# EAGLE design KLJN_DemoPanel_2 (EAGLE 5.11)
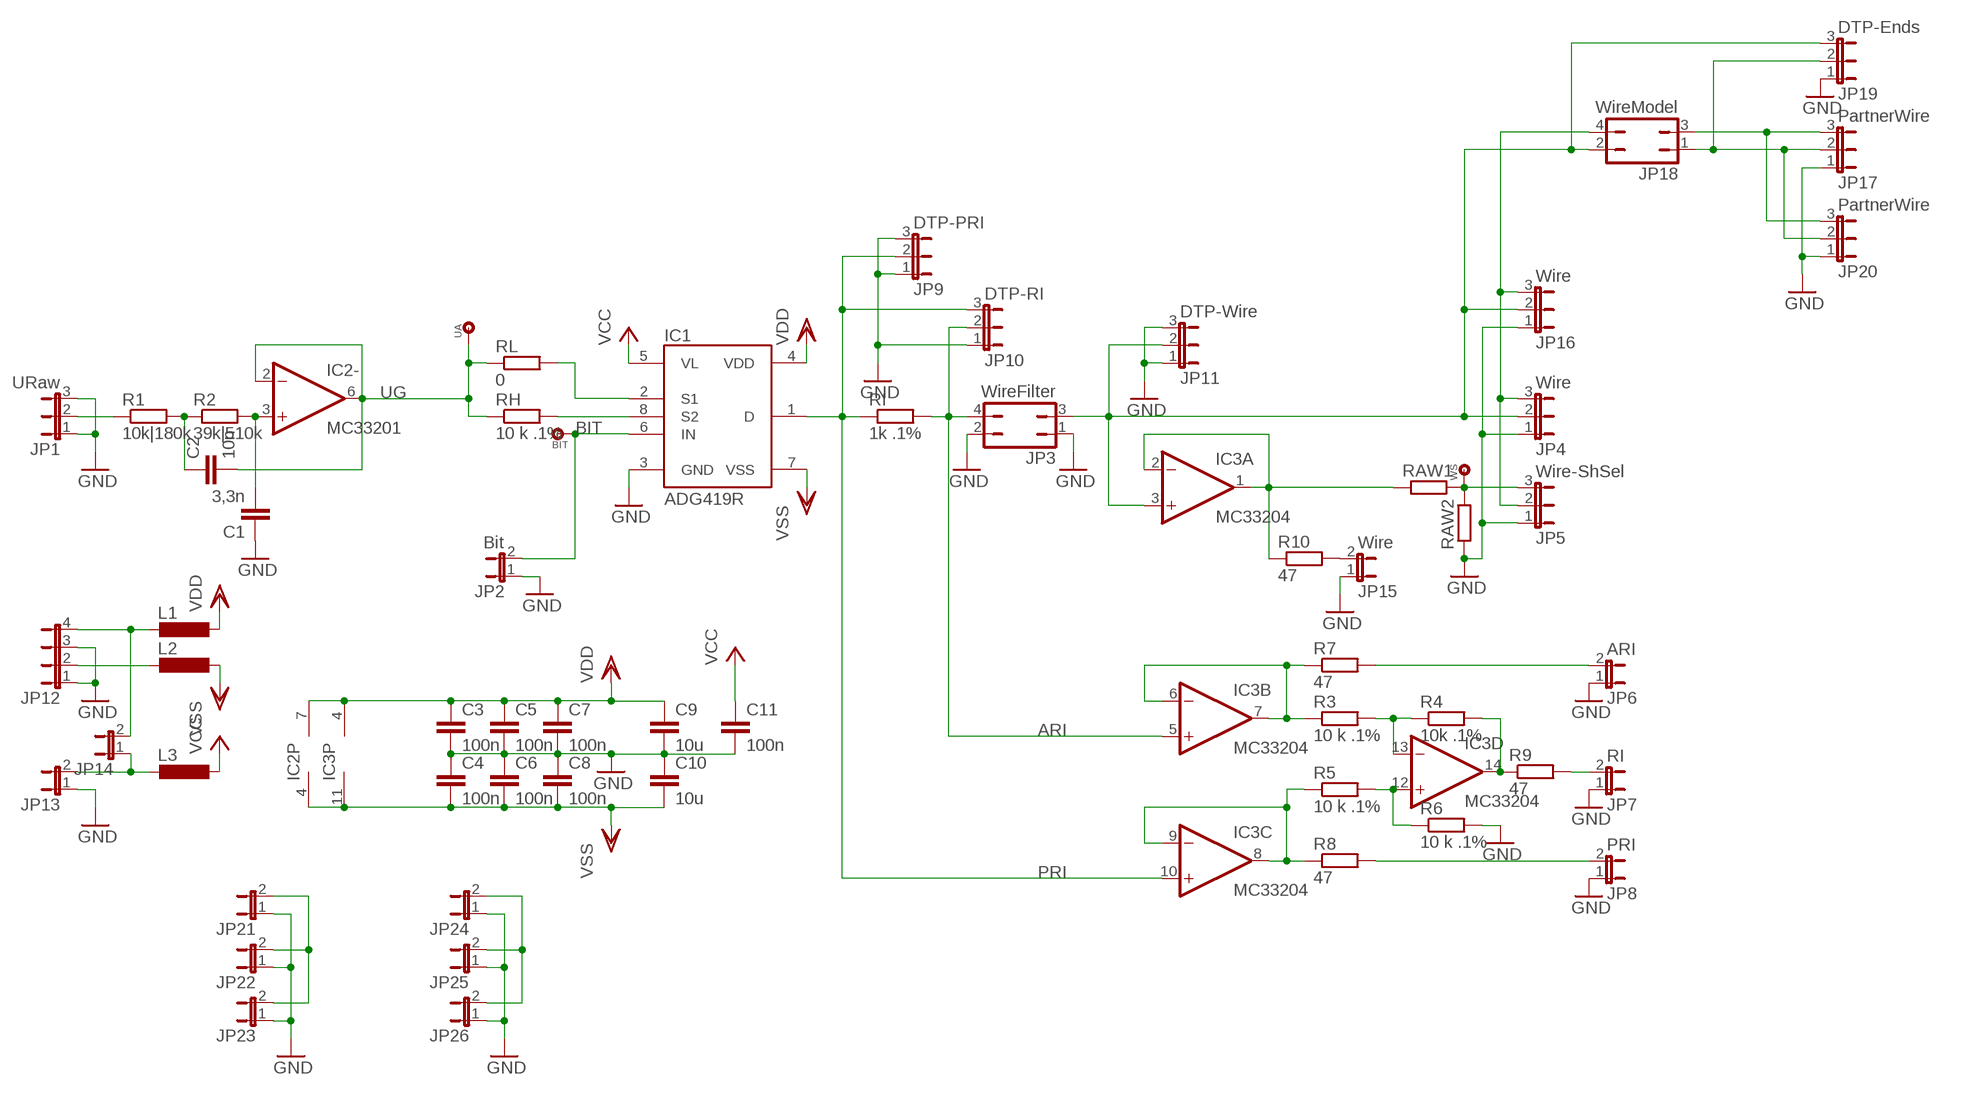
[diagram p0: schematic, sheet 1]

## Parts
BIT  TP  [JP1]
C1  3,3n  CJP  [RJ2_A]
C2  10n  CJP  [RJ2_A]
C3  100n  C1206  [C1206]
C4  100n  C0805  [C0805]
C5  100n  C0805  [C0805]
C6  100n  C0805  [C0805]
C7  100n  C1206  [C1206]
C8  100n  C0805  [C0805]
C9  10u  C0805  [C0805]
C10  10u  C0805  [C0805]
C11  100n  C0805  [C0805]
IC1  ADG419R  ADG419BR  [SO08]
IC2  MC33201  OPASO08  [SO08]
IC3  MC33204  OPA_QUADSO14  [SO14]
JP1  URaw  JP2E  [JP2]
JP2  Bit  JP1E  [JP1]
JP3  WireFilter  JP2Q  [JP2Q]
JP4  Wire  JP2E  [JP2]
JP5  Wire-ShSel  JP2E  [JP2]
JP6  ARI  JP1E  [JP1]
JP7  RI  JP1E  [JP1]
JP8  PRI  JP1E  [JP1]
JP9  DTP-PRI  JP2E  [JP2]
JP10  DTP-RI  JP2E  [JP2]
JP11  DTP-Wire  JP2E  [JP2]
JP12  JP4E  [JP4]
JP13  JP1E  [JP1]
JP14  JP1E  [JP1]
JP15  Wire  JP1E  [JP1]
JP16  Wire  JP2E  [JP2]
JP17  PartnerWire  JP2E  [JP2]
JP18  WireModel  JP2Q  [JP2Q]
JP19  DTP-Ends  JP2E  [JP2]
JP20  PartnerWire  JP2E  [JP2]
JP21  JP1E  [JP1]
JP22  JP1E  [JP1]
JP23  JP1E  [JP1]
JP24  JP1E  [JP1]
JP25  JP1E  [JP1]
JP26  JP1E  [JP1]
L1  L0805  [R0805]
L2  L0805  [R0805]
L3  L0805  [R0805]
R1  10k|180k  RJP  [RJ2_A]
R2  39k|510k  RJP  [RJ2_A]
R3  10 k .1%  R0805  [R0805]
R4  10k .1%  R0805  [R0805]
R5  10 k .1%  R1206  [R1206]
R6  10 k .1%  R0805  [R0805]
R7  47  R0805  [R0805]
R8  47  R1206  [R1206]
R9  47  R0805  [R0805]
R10  47  R0805  [R0805]
RAW1  RJP  [RJ2_A]
RAW2  RJP  [RJ2_A]
RH  10 k .1%  RJP  [RJ2_A]
RI  1k .1%  RJP  [RJ2_A]
RL  0  RJP  [RJ2_A]
UA  TP  [JP1]
WS  TP  [JP1]

## Nets
ARI: IC3.5(B:+IN) JP3.4 JP10.2 RI.2
BIT: BIT.1 IC1.6(IN) JP2.2
GND: C1.2 C3.1 C4.2 C5.1 C6.2 C7.1 C8.2 C9.1 C10.2 C11.1 IC1.3(GND) JP1.1 JP1.3 JP2.1 JP3.1 JP3.2 JP4.1 JP5.1 JP6.1 JP7.1 JP8.1 JP9.1 JP9.3 JP10.1 JP11.1 JP11.3 JP12.1 JP12.3 JP13.1 JP15.1 JP16.1 JP17.1 JP19.1 JP20.1 JP21.1 JP22.1 JP23.1 JP24.1 JP25.1 JP26.1 R6.2 RAW2.1
N$1: C2.2 R1.2 R2.1
N$2: JP21.2 JP22.2 JP23.2
N$3: IC1.8(S2) RH.2
N$4: IC1.2(S1) RL.2
N$5: IC3.3(A:+IN) JP3.3 JP4.2 JP11.2 JP16.2 JP18.2 JP19.3
N$6: IC3.1(A:OUT) IC3.2(A:-IN) R10.1 RAW1.1
N$7: JP5.3 RAW1.2 RAW2.2 WS.1
N$8: JP4.3 JP5.2 JP16.3 JP18.4
N$9: IC3.6(B:-IN) IC3.7(B:OUT) R3.1 R7.1
N$10: C1.1 IC2.3(-:+IN) R2.2
N$11: IC3.8(C:OUT) IC3.9(C:-IN) R5.1 R8.1
N$12: JP1.2 R1.1
N$13: IC3.13(D:-IN) R3.2 R4.1
N$14: IC3.12(D:+IN) R5.2 R6.1
N$15: IC3.14(D:OUT) R4.2 R9.1
N$16: JP6.2 R7.2
N$17: JP7.2 R9.2
N$18: JP8.2 R8.2
N$19: JP15.2 R10.2
N$20: JP13.2 JP14.1 L3.1
N$21: JP12.4 JP14.2 L1.1
N$22: JP12.2 L2.1
N$23: JP17.3 JP18.3 JP20.3
N$24: JP17.2 JP18.1 JP19.2 JP20.2
N$25: JP24.2 JP25.2 JP26.2
PRI: IC1.1(D) IC3.10(C:+IN) JP9.2 JP10.3 RI.1
UG: C2.1 IC2.2(-:-IN) IC2.6(-:OUT) RH.1 RL.1 UA.1
VCC: C11.2 IC1.5(VL) L3.2
VDD: C3.2 C5.2 C7.2 C9.2 IC1.4(VDD) IC2.7(P:V+) IC3.4(P:V+) L1.2
VSS: C4.1 C6.1 C8.1 C10.1 IC1.7(VSS) IC2.4(P:V-) IC3.11(P:V-) L2.2

## Library data of the parts
BIT UA WS = MRobi:TP: Test Pin
C1-C11 = MRobi:C: Capacitor
IC1 = MRobi:ADG419
IC2 = MRobi:OPA: Single OP-Amp
IC3 = NoiseIC:OPA_QUAD: Quad OP-Amp
JP1 JP4 JP5 JP9-JP11 JP16 JP17 JP19 JP20 = jumper:JP2E: JUMPER
JP2 JP6-JP8 JP13-JP15 JP21-JP26 = jumper:JP1E: JUMPER
JP3 JP18 = jumper:JP2Q: JUMPER
JP12 = jumper:JP4E: JUMPER
L1-L3 = NoiseRLC:L: Inductance
R1 R2 RAW1 RAW2 RH RI RL = MRobi:R: Resistor
R3-R10 = NoiseRLC:R: Resistor

## Board
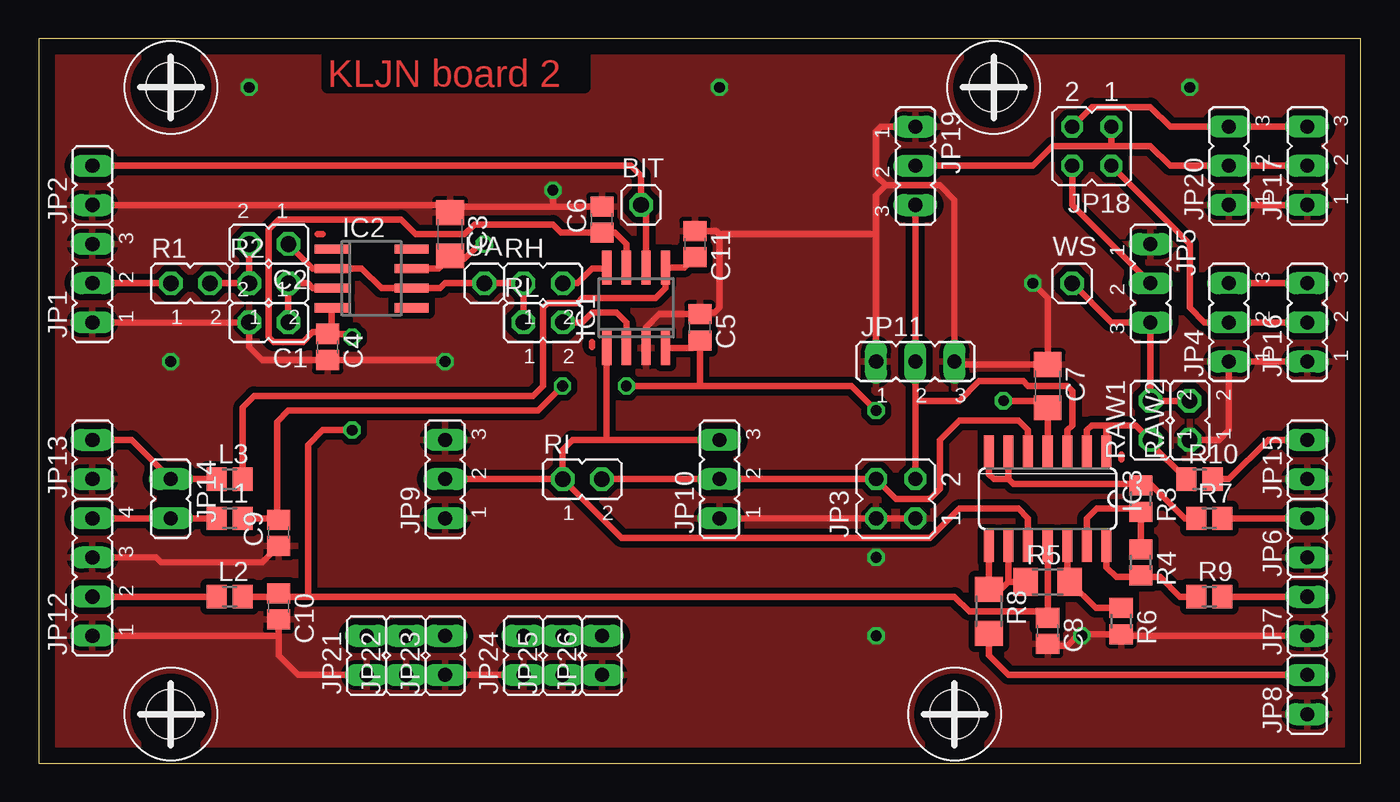
[diagram p1: board, top side]
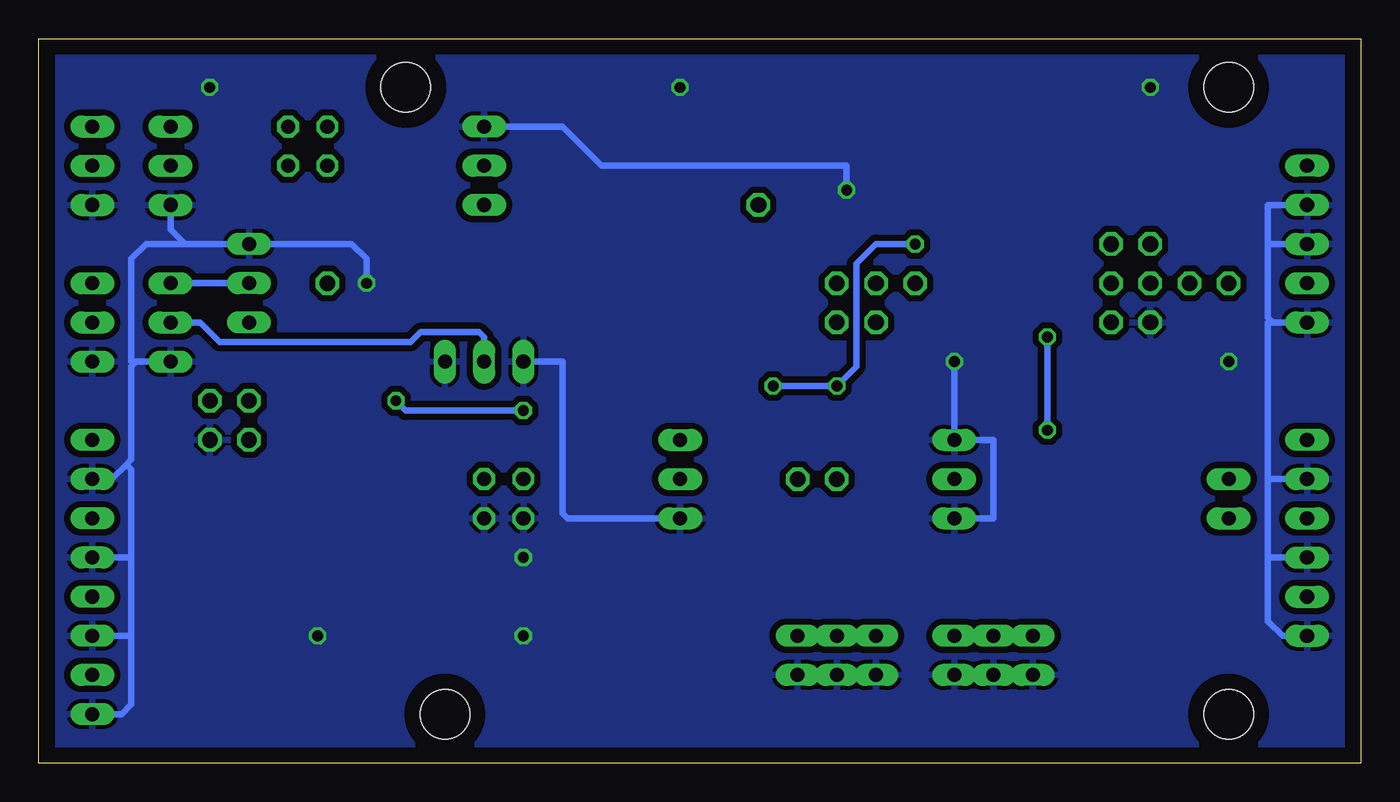
[diagram p2: board, bottom side, seen from below]

Size 85.71 x 46.98 mm. Coordinates in mm from the lower left corner, seen from the top.
Outline: 0,0 85.71,0 85.71,46.98 0,46.98 0,0
Copper layers (1*16): Top 0.035mm / dielectric 1.5mm / Bottom 0.035mm
Design rules "default": minimum track width 10mil, minimum drill 24mil, track to track 8mil, track to pad 8mil, pad to pad 8mil, via to via 8mil, smd to smd 8mil, copper to edge 40mil, drill to drill 8mil, minimum pad ring 10mil, minimum via ring 8mil, stop-mask expansion 4mil, vias tented up to drill 0mil, thermal gap 10mil

### Footprints (pad centres in the part's own frame; a part is rotated, then mirrored left to right if it is on the bottom)
JP1 = drill 1.016 octagon: 1 0,0
RJ2_A = drill 1.016 octagon: 1 -1.27,0; 2 1.27,0
C1206 = smd 1.6 x 1.8: 1 -1.4,0; 2 1.4,0
C0805 = smd 1.3 x 1.5: 1 -0.85,0; 2 0.85,0
SO08 = smd 0.6 x 2.2: 1 -1.905,-2.6; 2 -0.635,-2.6; 3 0.635,-2.6; 4 1.905,-2.6; 5 1.905,2.6; 6 0.635,2.6; 7 -0.635,2.6; 8 -1.905,2.6
SO14 = smd 0.66 x 2.032: 1 -3.81,-3.073; 2 -2.54,-3.073; 3 -1.27,-3.073; 4 0,-3.073; 5 1.27,-3.073; 6 2.54,-3.073; 7 3.81,-3.073; 8 3.81,3.073; 9 2.54,3.073; 10 1.27,3.073; 11 0,3.073; 12 -1.27,3.073; 13 -2.54,3.073; 14 -3.81,3.073
JP2 = drill 0.914 long: 1 -2.54,0; 2 0,0; 3 2.54,0
JP1' = drill 0.914 long: 1 0,-1.27; 2 0,1.27
JP2Q = drill 0.914 octagon: 1 -1.27,-1.27; 2 -1.27,1.27; 3 1.27,-1.27; 4 1.27,1.27
JP4 = drill 0.914 long: 1 -3.81,0; 2 -1.27,0; 3 1.27,0; 4 3.81,0
R0805 = smd 1.3 x 1.5: 1 -0.85,0; 2 0.85,0
R1206 = smd 1.6 x 1.803: 1 -1.422,0; 2 1.422,0
SCREW_M3 = hole 3.2: 0,0

### Placement (x,y rotation side)
BIT  39.05,36.2 0 top
C1  14.92,28.58 180 top
C2  14.92,33.66 180 top
C3  26.67,34.29 270 top
C4  18.73,26.99 270 top
C5  42.86,28.26 270 top
C6  36.51,35.24 90 top
C7  65.41,24.45 270 top
C8  65.41,8.57 270 top
C9  15.56,14.92 90 top
C10  15.56,10.16 270 top
C11  42.55,33.66 270 top
IC1  38.73,29.53 0 top
IC2  21.59,31.43 270 top
IC3  65.41,17.14 180 top
JP1  3.49,31.12 90 top
JP2  Bit  [JP1']  3.49,37.46 0 top
JP3  55.56,17.14 90 top
JP4  77.15,28.58 90 top
JP5  72.07,31.12 270 top
JP6  ARI  [JP1']  82.23,14.61 0 top
JP7  RI  [JP1']  82.23,9.53 0 top
JP8  PRI  [JP1']  82.23,4.45 0 top
JP9  26.35,18.41 90 top
JP10  44.13,18.41 90 top
JP11  56.83,26.04 0 top
JP12  3.49,12.07 90 top
JP13  [JP1']  3.49,19.68 0 top
JP14  [JP1']  8.57,17.14 180 top
JP15  Wire  [JP1']  82.23,19.68 0 top
JP16  82.23,28.58 90 top
JP17  82.23,38.73 90 top
JP18  68.26,40.01 180 top
JP19  56.83,38.73 270 top
JP20  77.15,38.73 90 top
JP21  [JP1']  21.27,6.98 0 top
JP22  [JP1']  23.81,6.98 0 top
JP23  [JP1']  26.35,6.98 0 top
JP24  [JP1']  31.43,6.98 0 top
JP25  [JP1']  33.97,6.98 0 top
JP26  [JP1']  36.51,6.98 0 top
L1  12.38,15.88 0 top
L2  12.38,10.79 0 top
L3  12.38,18.41 0 top
R1  9.84,31.12 0 top
R2  14.92,31.12 0 top
R3  71.44,17.14 270 top
R4  71.44,13.02 270 top
R5  65.41,11.75 0 top
R6  70.17,9.21 270 top
R7  75.88,15.88 0 top
R8  61.59,9.84 270 top
R9  75.88,10.79 0 top
R10  75.25,18.41 0 top
RAW1  72.07,22.23 90 top
RAW2  74.61,22.23 90 top
RH  32.7,31.12 0 top
RI  35.24,18.41 0 top
RL  32.7,28.58 0 top
U$1  [SCREW_M3]  8.57,3.17 0 top
U$2  [SCREW_M3]  59.37,3.17 0 top
U$3  [SCREW_M3]  8.57,43.81 0 top
U$4  [SCREW_M3]  61.91,43.81 0 top
UA  28.89,31.12 0 top
WS  66.99,31.12 0 top

### Tracks (layer width: path | path; a pad name or v marks a point on that pad's centre or on a via)
ARI
  Top 0.406: RI.2 JP10.2 JP3.4 55.56,17.14 57.79,17.14 58.42,17.78 58.42,20.95 59.69,22.23 63.5,22.23 64.13,21.59 IC3.5
BIT
  Top 0.406: IC1.6 39.37,35.88 BIT.1 39.05,38.1 38.42,38.73 JP2.2
GND  (via drill 0.7)
  Top 0.406: JP1.1 C1.2 13.65,26.99 14.5,26.14 C4.2 26.25,26.14 v26.35,26.04 | JP10.1 JP3.2 JP3.1 | 54.93,37.46 58.42,37.46 59.37,36.51 JP11.3 59.56,25.85 C7.1 65.41,30.16 v64.45,31.12 | 54.93,37.46 54.29,38.1 54.29,40.96 54.61,41.27 JP19.1 | 54.29,34.29 54.29,36.83 54.93,37.46 | 54.29,34.29 JP11.1 | IC1.3 39.37,28.26 40.22,29.11 C5.1 42.97,29.21 43.82,29.21 44.13,29.53 44.13,34.29 | C11.1 43.92,34.51 44.13,34.29 | JP20.1 JP17.1 | JP16.1 JP4.1 77.15,21.59 76.52,20.95 RAW2.1 | JP7.1 70.49,8.25 70.38,8.36 R6.2 67.41,8.36 66.68,7.62 65.51,7.62 C8.2 | JP26.1 JP25.1 JP24.1 JP23.1 JP22.1 JP21.1 16.83,5.71 15.56,6.98 15.56,8.25 | 15.56,8.25 C10.2 | JP12.1 15.56,8.25 | JP12.3 7.62,13.34 7.94,13.02 14.5,13.02 C9.1 | 54.29,34.29 44.13,34.29 | v33.34,37.15 33.34,36.09 C6.2 27.07,36.09 C3.1 26.67,36.2 JP2.1
  Bottom 0.406: JP20.1 77.15,34.61 76.2,33.66 | v64.45,31.12 64.45,32.7 65.41,33.66 JP5.1 76.2,33.66 | 76.2,33.66 78.74,33.66 79.69,32.7 79.69,26.04 79.38,26.04 | 79.38,26.04 JP4.1 | JP15.1 80.96,18.41 80.01,19.37 | 80.01,19.37 79.69,19.68 79.69,25.72 79.38,26.04 | 79.69,13.34 JP6.1 | 79.69,13.34 79.69,19.05 80.01,19.37 | 79.69,13.34 79.69,8.25 | 79.69,8.25 79.69,3.81 80.33,3.17 JP8.1 | 79.69,8.25 JP7.1 | 6.03,13.34 6.03,9.21 5.08,8.25 JP12.1 | 6.03,13.34 JP12.3 | 6.03,13.34 6.03,18.41 | 6.03,18.41 JP13.1 | 6.03,18.41 6.03,28.58 5.72,28.58 | 5.72,28.58 JP1.1 | JP2.1 6.03,36.2 6.03,33.66 | 6.03,33.66 6.03,28.89 5.72,28.58 | 6.03,33.66 JP1.3 | v26.35,26.04 JP9.3 23.81,20.95 23.81,15.88 JP9.1 | v33.34,37.15 33.34,38.73 49.21,38.73 51.75,41.27 JP19.1 | JP11.1 51.75,26.04 51.75,16.19 51.44,15.88 JP10.1
  other vias: 54.29,13.34 54.29,8.25 67.63,8.25 8.57,26.04 13.65,43.81 44.13,43.81 74.61,43.81
  pour Top (isolate 0.406): 0.95,46.35 84.77,46.35 84.77,0.63 0.95,0.63
  pour Bottom (isolate 0.406): 0.95,46.35 84.77,46.35 84.77,0.63 0.95,0.63
N$1
  Top 0.406: R1.2 R2.1 C2.2
N$2
  Top 0.406: JP21.2 JP22.2 JP23.2
N$3
  Top 0.406: RH.2 34.93,31.12 35.88,32.07 36.77,32.07 IC1.8
N$4
  Top 0.406: RL.2 35.24,28.58 35.88,29.21 37.47,29.21 38.1,28.58 IC1.2
N$5
  Top 0.406: JP3.3 56.83,23.5 | 56.83,23.5 JP11.2 JP19.3 | 56.83,23.5 59.69,23.5 60.96,24.77 63.82,24.77 64.13,24.45 66.68,24.45 66.99,24.13 66.99,21.91 66.68,21.59 IC3.3 | JP16.2 JP4.2 75.57,28.58 74.61,29.53 74.61,33.66 JP18.2
  Bottom 0.406: JP4.2 75.25,28.58 73.98,27.3 61.59,27.3 60.96,27.94 57.15,27.94 56.83,27.62 JP11.2
N$6
  Top 0.406: IC3.2 67.94,21.59 68.26,21.91 69.21,21.91 | 69.21,21.91 71.12,21.91 RAW1.1 72.07,20.74 R10.1 | IC3.1 69.21,21.91
N$7
  Top 0.406: WS.1 69.53,28.58 JP5.3 RAW1.2 RAW2.2
N$8
  Top 0.406: JP4.3 JP16.3 | JP5.2 66.99,36.2 JP18.4
  Bottom 0.406: JP5.2 JP4.3
N$9
  Top 0.406: 62.87,18.41 IC3.6 | 62.87,18.41 63.18,18.1 71.33,18.1 R3.1 72.18,18 74.29,15.88 R7.1 | IC3.7 61.59,18.73 61.91,18.41 62.87,18.41
N$10
  Top 0.406: IC2.3 17.78,30.8 17.46,31.12 R2.2 C1.1
N$11
  Top 0.406: 62.87,11.75 IC3.9 | 62.87,11.75 R5.1 | 62.87,11.75 62.38,11.27 R8.1 IC3.8
N$12
  Top 0.406: JP1.2 R1.1
N$13
  Top 0.406: IC3.13 67.94,15.88 68.58,16.51 71.22,16.51 R3.2 R4.1
N$14
  Top 0.406: IC3.12 66.68,11.9 R5.2 68.52,10.06 R6.1
N$15
  Top 0.406: IC3.14 69.21,12.7 69.85,12.07 71.33,12.07 R4.2 71.54,12.07 72.71,12.07 73.98,10.79 R9.1
N$16
  Top 0.406: R7.2 JP6.2
N$17
  Top 0.406: R9.2 JP7.2
N$18
  Top 0.406: JP8.2 62.87,5.71 61.59,6.98 R8.2
N$19
  Top 0.406: R10.2 77.15,18.41 79.69,20.95 JP15.2
N$20
  Top 0.406: JP13.2 6.03,20.95 JP14.1 L3.1
N$21
  Top 0.406: JP12.4 JP14.2 L1.1
N$22
  Top 0.406: JP12.2 L2.1
N$23
  Top 0.406: JP18.3 68.26,42.55 72.07,42.55 73.34,41.27 JP20.3 JP17.3
N$24
  Top 0.406: JP19.2 64.45,38.73 65.72,40.01 69.53,40.01 | 69.53,40.01 72.07,40.01 73.34,38.73 JP20.2 JP17.2 | 69.53,40.01 JP18.1
N$25
  Top 0.406: JP24.2 JP25.2 JP26.2
N$26
  Top 0.406: 18.42,34.29 18.1,34.29
N$27
  Top 0.406: 35.88,26.99 35.88,27.3
N$28
  Top 0.406: 70.17,19.68 70.17,20
PRI
  Top 0.406: 36.83,20.95 IC1.1 | 36.83,20.95 34.61,20.95 33.97,20.32 RI.1 | JP9.2 RI.1 | 36.83,20.95 JP10.3 | IC3.10 64.13,15.88 63.5,16.51 59.69,16.51 57.79,14.61 37.78,14.61 RI.1
UG
  Top 0.406: C2.1 17.78,32.07 IC2.2 20.96,32.07 22.22,30.8 IC2.6 26.03,30.8 26.35,31.12 UA.1 RH.1 RL.1
VCC
  Top 0.406: L3.2 13.23,23.07 13.97,23.81 32.07,23.81 32.7,24.45 32.7,29.53 33.02,29.84 34.93,29.84 35.24,30.16 40.01,30.16 40.64,30.8 IC1.5 41.87,32.13 C11.2
VDD  (via drill 0.7)
  Top 0.406: IC3.4 C7.2 64.96,23.5 v62.55,23.5 | L1.2 15.46,15.88 | 15.46,15.88 C9.2 | 15.46,15.88 15.46,22.12 16.19,22.86 32.38,22.86 v33.97,24.45 | v28.89,33.66 28.58,33.66 27.62,32.7 26.57,32.7 C3.2 25.93,32.07 IC2.7 | v38.1,24.45 42.86,24.45 | 42.86,24.45 C5.2 42.38,26.93 IC1.4 | 42.86,24.45 52.7,24.45 v54.29,22.86
  Bottom 0.406: v28.89,33.66 31.43,33.66 32.7,32.38 32.7,25.72 v33.97,24.45 v38.1,24.45 | v54.29,22.86 61.91,22.86 v62.55,23.5
VSS  (via drill 0.7)
  Top 0.406: L2.2 15.34,10.79 C10.1 15.66,11.01 15.87,10.79 17.46,10.79 | 17.46,10.79 59.37,10.79 60.33,9.84 64.99,9.84 C8.1 IC3.11 | C4.1 20.1,27.84 v20.32,27.62 | v20.32,21.59 18.42,21.59 17.46,20.64 17.46,10.79 | IC2.4 18.99,28.09 C4.1 | C4.1 18.63,27.94 17.78,27.94 17.15,27.3 15.24,27.3 14.92,27.62 14.92,34.61 15.56,35.24 23.49,35.24 24.45,34.29 27.62,34.29 28.26,34.92 33.34,34.92 33.87,34.39 C6.1 37.36,34.39 38.1,33.66 IC1.7
  Bottom 0.406: v20.32,21.59 v20.32,27.62

### Text on the board
Top: KLJN board 2